# Altium schematic sheet 3VoltRegulator.SchDoc
size A
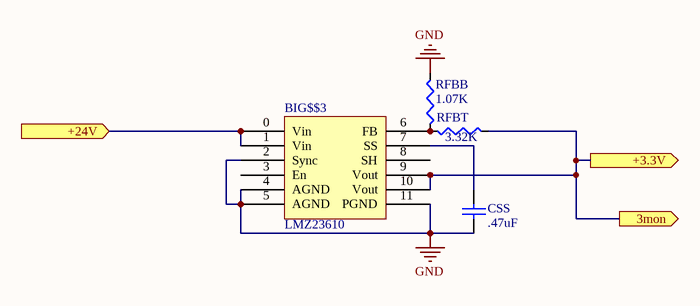
[diagram p0: 3VoltRegulator.SchDoc]

## Parts
BIG$$3  LMZ23610  [LMZ23610]
CSS  .47uF  [0805 (2012) Capacitor]
RFBB  1.07K  [R 0805 (2012) RESISTOR]
RFBT  3.32K  [R 0805 (2012) RESISTOR]

## Ports
3mon (out), +3.3V (out), +24V (in)

## Nets
GND: BIG$$3.2(Sync) BIG$$3.4(AGND) BIG$$3.5(AGND) BIG$$3.11(PGND) CSS.1 RFBB.2
+3.3V: BIG$$3.9(Vout) BIG$$3.10(Vout) RFBT.2 ; port +3.3V, port 3mon
+24V: BIG$$3.0(Vin) BIG$$3.1(Vin) ; port +24V
NetBIG$$3_6: BIG$$3.6(FB) RFBB.1 RFBT.1
NetBIG$$3_7: BIG$$3.7(SS) CSS.2

Not connected (* = marked no-connect by the designer): BIG$$3 3(En) 8(SH)

## Library data of the parts
CSS = Capacitor (non-polarized): Capacitor; Value: .1uF
RFBB RFBT = Resistor: Value: 0Ohm